# EAGLE design yaca-base (EAGLE 5.11)
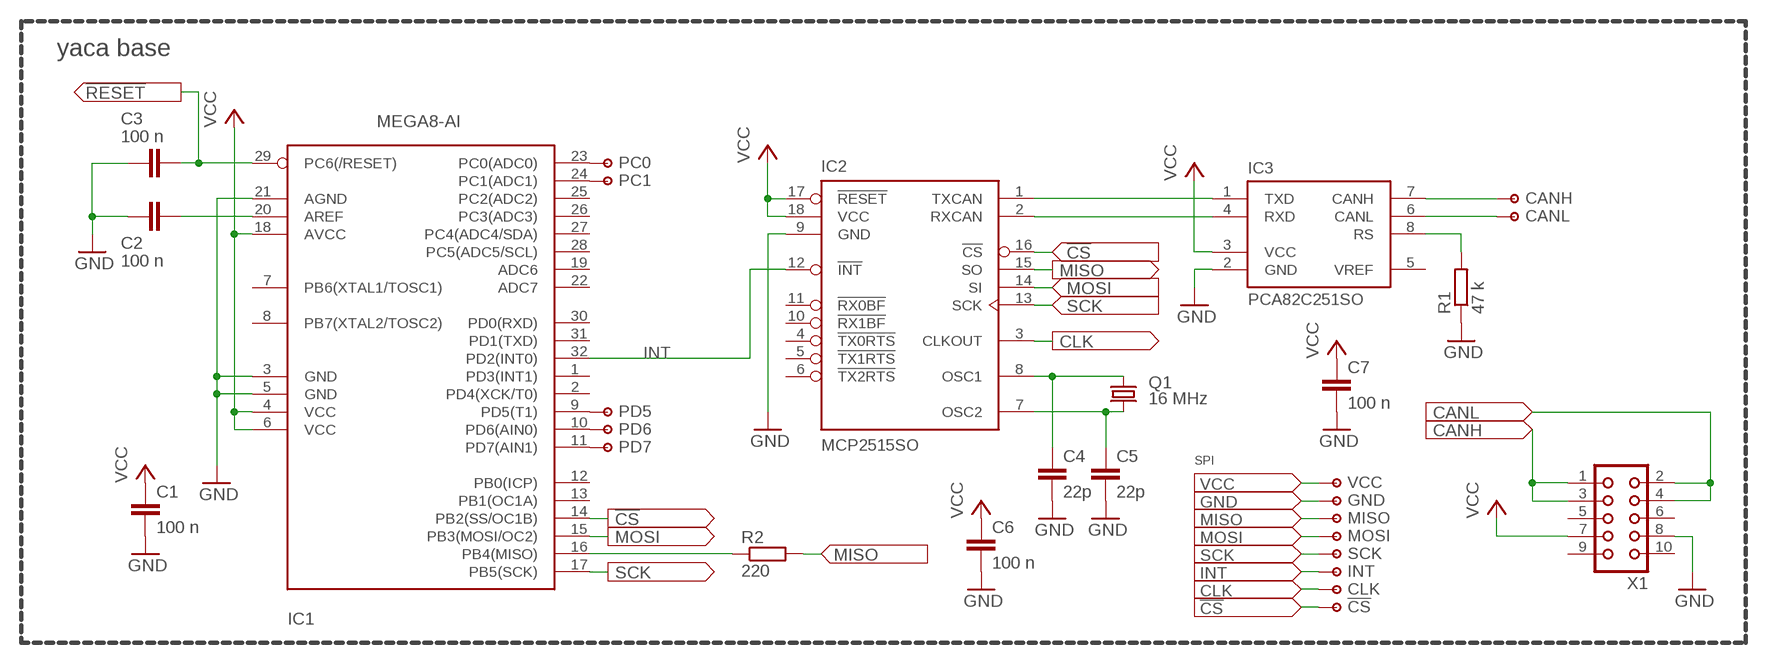
[diagram p0: schematic, sheet 1]

## Parts
C1  100 n  C-EUC0805  [C0805]
C2  100 n  C-EUC0805  [C0805]
C3  100 n  C-EUC1206  [C1206]
C4  22p  C-EUC1206  [C1206]
C5  22p  C-EUC1206  [C1206]
C6  100 n  C-EUC1206  [C1206]
C7  100 n  C-EUC1206  [C1206]
IC1  MEGA8-AI  [TQFP32-08]
IC2  MCP2515SO  [SO18]
IC3  PCA82C251SO  [SO08]
P1  VCC  PAD  [PAD]
P2  GND  PAD  [PAD]
P3  MISO  PAD  [PAD]
P4  MOSI  PAD  [PAD]
P5  SCK  PAD  [PAD]
P6  INT  PAD  [PAD]
P7  CANH  PAD  [PAD]
P8  CANL  PAD  [PAD]
P9  CLK  PAD  [PAD]
P10  !CS  PAD  [PAD]
P11  PC0  PAD  [PAD]
P12  PC1  PAD  [PAD]
P13  PD6  PAD  [PAD]
P14  PD7  PAD  [PAD]
P15  PD5  PAD  [PAD]
Q1  16 MHz  CRYSTALSM49  [SM49]
R1  47 k  R-EU_R0805  [R0805]
R2  220  R-EU_R0805  [R0805]
X1  CON10  [CON10]

## Nets
!CS: IC1.14(PB2(SS/OC1B)) IC2.16(!CS) P10.1(P)
!RESET: C3.1 IC1.29(PC6(/RESET))
CANH: IC3.7(CANH) P7.1(P) X1.1 X1.3
CANL: IC3.6(CANL) P8.1(P) X1.2 X1.4
CLK: IC2.3(CLKOUT) P9.1(P)
GND: C1.2 C2.2 C3.2 C4.2 C5.2 C6.2 C7.2 IC1.3(GND) IC1.5(GND) IC1.21(AGND) IC2.9(GND) IC3.2(GND) P2.1(P) R1.1 X1.8
INT: IC1.32(PD2(INT0)) IC2.12(!INT) P6.1(P)
MISO: IC2.15(SO) P3.1(P) R2.2
MOSI: IC1.15(PB3(MOSI/OC2)) IC2.14(SI) P4.1(P)
N$1: IC1.16(PB4(MISO)) R2.1
N$2: C2.1 IC1.20(AREF)
N$3: IC1.23(PC0(ADC0)) P11.1(P)
N$4: IC1.24(PC1(ADC1)) P12.1(P)
N$5: IC1.10(PD6(AIN0)) P13.1(P)
N$6: IC1.11(PD7(AIN1)) P14.1(P)
N$7: IC1.9(PD5(T1)) P15.1(P)
RS: IC3.8(RS) R1.2
RXCAN: IC2.2(RXCAN) IC3.4(RXD)
SCK: IC1.17(PB5(SCK)) IC2.13(SCK) P5.1(P)
TXCAN: IC2.1(TXCAN) IC3.1(TXD)
VCC: C1.1 C6.1 C7.1 IC1.4(VCC) IC1.6(VCC) IC1.18(AVCC) IC2.17(!RESET) IC2.18(VCC) IC3.3(VCC) P1.1(P) X1.7
X1: C4.1 IC2.8(OSC1) Q1.1
X2: C5.1 IC2.7(OSC2) Q1.2
Unconnected: IC1.1(PD3(INT1)) IC1.2(PD4(XCK/T0)) IC1.7(PB6(XTAL1/TOSC1)) IC1.8(PB7(XTAL2/TOSC2)) IC1.12(PB0(ICP)) IC1.13(PB1(OC1A)) IC1.19(ADC6) IC1.22(ADC7) IC1.25(PC2(ADC2)) IC1.26(PC3(ADC3)) IC1.27(PC4(ADC4/SDA)) IC1.28(PC5(ADC5/SCL)) IC1.30(PD0(RXD)) IC1.31(PD1(TXD)) IC2.4(!TX0RTS) IC2.5(!TX1RTS) IC2.6(!TX2RTS) IC2.10(!RX1BF) IC2.11(!RX0BF) IC3.5(VREF) X1.5 X1.6 X1.9 X1.10

## Notes on the sheet
- yaca base
- SPI

## Library data of the parts
C1-C7 = rcl:C-EU: CAPACITOR, European symbol
IC1 = atmel:MEGA8: MICROCONTROLLER 8 Kbytes FLASH, 1 kbytes SRAM, 512 bytes EEPROM, USART, 6-channel 10 bit ADC, 2-channel 8 bit ADC Pin compatible with Atmega48, ATMega88, ATMega168 Source: avr.lbr
IC2 = yaca:MCP2515: MCP2515 CAN controller from Microchip
IC3 = yaca:PCA82C251: PCA82C251 or MCP2551 CAN transceivers
P1-P15 = yaca:PAD: SMD soldering pad
Q1 = crystal:CRYSTAL: CRYSTAL
R1 R2 = rcl:R-EU_: RESISTOR, European symbol
X1 = con-harting:CON10: CONNECTOR; OC_FARNELL: unknown; OC_NEWARK: unknown

## Board
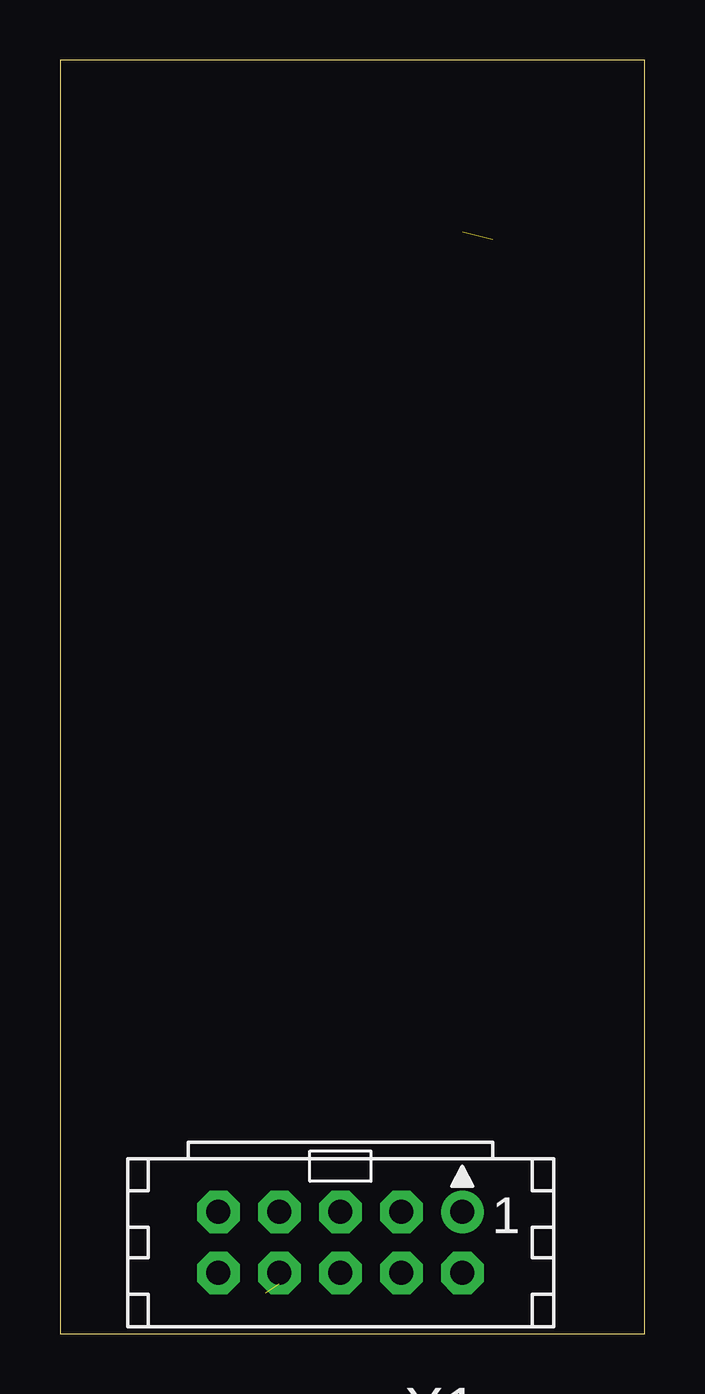
[diagram p1: board, top side]
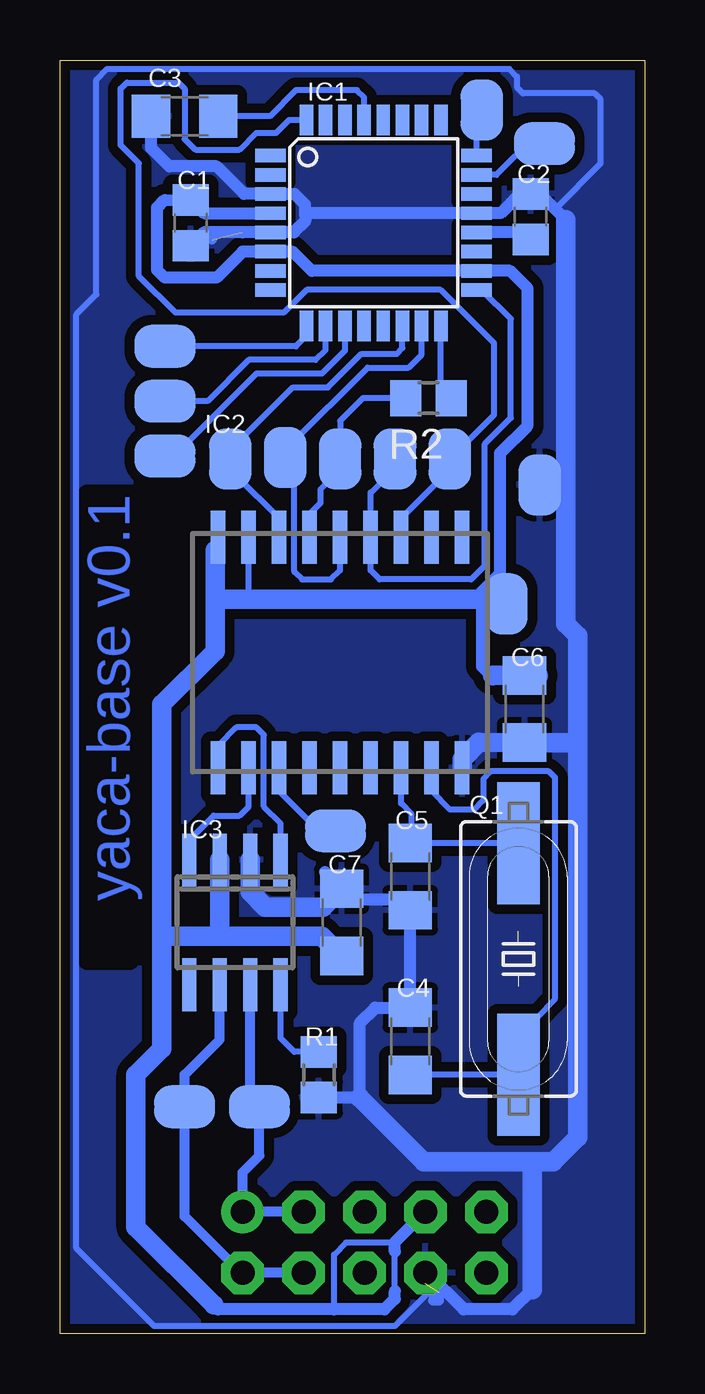
[diagram p2: board, bottom side, seen from below]

Size 24.37 x 53.08 mm. Coordinates in mm from the lower left corner, seen from the top.
Outline: 0,0 24.37,0 24.37,53.08 0,53.08 0,0
Copper layers (1*16): Top 0.035mm / dielectric 1.5mm / Bottom 0.035mm
Design rules "default *": minimum track width 10mil, minimum drill 24mil, track to track 8mil, track to pad 8mil, pad to pad 8mil, via to via 8mil, smd to smd 8mil, copper to edge 8mil, drill to drill 8mil, minimum pad ring 10mil, minimum via ring 8mil, stop-mask expansion 4mil, vias tented up to drill 0mil, thermal gap 10mil

### Footprints (pad centres in the part's own frame; a part is rotated, then mirrored left to right if it is on the bottom)
C0805 = smd 1.3 x 1.5: 1 -0.95,0; 2 0.95,0
C1206 = smd 1.6 x 1.8: 1 -1.4,0; 2 1.4,0
TQFP32-08 = smd 1.27 x 0.559: 1 -4.293,2.8; 2 -4.293,2; 3 -4.293,1.2; 4 -4.293,0.4; 5 -4.293,-0.4; 6 -4.293,-1.2; 7 -4.293,-2; 8 -4.293,-2.8; 17 4.293,-2.8; 18 4.293,-2; 19 4.293,-1.2; 20 4.293,-0.4; 21 4.293,0.4; 22 4.293,1.2; 23 4.293,2; 24 4.293,2.8 | smd 0.559 x 1.27: 9 -2.8,-4.293; 10 -2,-4.293; 11 -1.2,-4.293; 12 -0.4,-4.293; 13 0.4,-4.293; 14 1.2,-4.293; 15 2,-4.293; 16 2.8,-4.293; 25 2.8,4.293; 26 2,4.293; 27 1.2,4.293; 28 0.4,4.293; 29 -0.4,4.293; 30 -1.2,4.293; 31 -2,4.293; 32 -2.8,4.293
SO18 = smd 0.6 x 2.2: 1 -5.08,-4.8; 2 -3.81,-4.8; 3 -2.54,-4.8; 4 -1.27,-4.8; 5 0,-4.8; 6 1.27,-4.8; 7 2.54,-4.8; 8 3.81,-4.8; 9 5.08,-4.8; 10 5.08,4.8; 11 3.81,4.8; 12 2.54,4.8; 13 1.27,4.8; 14 0,4.8; 15 -1.27,4.8; 16 -2.54,4.8; 17 -3.81,4.8; 18 -5.08,4.8
SO08 = smd 0.6 x 2.2: 1 -1.905,-2.6; 2 -0.635,-2.6; 3 0.635,-2.6; 4 1.905,-2.6; 5 1.905,2.6; 6 0.635,2.6; 7 -0.635,2.6; 8 -1.905,2.6
PAD = smd 2.54 x 1.778: 1 0,0
SM49 = smd 5.08 x 1.778: 1 -4.826,0; 2 4.826,0
R0805 = smd 1.3 x 1.5: 1 -0.95,0; 2 0.95,0
CON10 = drill 1 pad 1.778 round: 1 -5.08,-1.27 | drill 1 pad 1.778 octagon: 2 -5.08,1.27; 3 -2.54,-1.27; 4 -2.54,1.27; 5 0,-1.27; 6 0,1.27; 7 2.54,-1.27; 8 2.54,1.27; 9 5.08,-1.27; 10 5.08,1.27

### Placement (x,y rotation side)
C1  18.92,46.29 270 bottom
C2  4.76,46.55 90 bottom
C3  19.18,50.74 180 bottom
C4  9.78,12.19 90 bottom
C5  9.78,19.05 270 bottom
C6  5.02,26.04 270 bottom
C7  12.64,17.14 90 bottom
IC1  11.3,46.29 0 bottom
IC2  12.7,28.38 0 bottom
IC3  17.08,17.14 180 bottom
P1  5.78,30.42 90 bottom
P2  4.38,35.37 270 bottom
P3  12.7,36.45 270 bottom
P4  14.99,36.51 90 bottom
P5  10.41,36.45 270 bottom
P6  8.13,36.45 270 bottom
P7  16.07,9.46 180 bottom
P8  19.18,9.46 0 bottom
P9  12.89,20.95 0 bottom
P10  17.27,36.45 270 bottom
P11  4.19,49.59 0 bottom
P12  6.79,50.99 270 bottom
P13  20,38.86 0 bottom
P14  20,36.58 0 bottom
P15  20,41.15 180 bottom
Q1  5.27,15.62 90 bottom
R1  13.59,10.79 90 bottom
R2  9.02,38.99 180 bottom
X1  11.68,3.81 180 top

### Tracks (layer width: path | path; a pad name or v marks a point on that pad's centre or on a via)
!CS
  Bottom 0.254: IC2.16 15.24,33.97 17.02,35.75 17.02,36.2 P10.1 17.08,36.64 17.08,37.02 14.67,39.43 13.21,39.43 11.81,40.83 10.35,40.83 10.1,41.08 IC1.14
!RESET
  Bottom 0.254: C3.1 15.62,50.74 14.54,51.82 12,51.82 11.7,51.52 IC1.29
CANH
  Bottom 0.254: IC3.7 16.45,15.3
  Bottom 0.406: IC3.7 16.45,9.84 P7.1 16.07,7.43 16.76,6.73 X1.1 X1.3
CANL
  Bottom 0.406: IC3.6 17.72,12.26 19.18,10.79 P8.1 19.18,4.89 16.83,2.54 X1.2 X1.4
CLK
  Bottom 0.254: IC2.3 15.24,22.61 13.91,21.27 13.21,21.27 P9.1
GND  (2 unrouted)
  Bottom 0.254: 12.32,18.09 C7.2 | P2.1 3.68,35.37 3.3,34.99 | 9.08,2.54 X1.8 9.14,2.1 9.14,1.59 10.41,0.32 20.45,0.32 23.69,3.56 23.69,42.48 22.86,43.31 22.86,52.26 22.42,52.7 5.65,52.7 5.33,52.39 5.33,51.94 5.08,51.69 2.1,51.69 1.84,51.44 1.84,48.77 3.75,46.86
  Bottom 0.406: 16.78,45.89 18.03,45.89 18.03,45.59 | 9.14,2.1 8.83,2.1 8.83,1.4 8.57,1.4 8.57,1.71
  Bottom 0.508: C1.2 18.37,45.89 16.78,45.89 IC1.5 14.62,45.89 14.16,46.35 14.16,46.61 | 14.16,46.61 14.16,47.05 14.6,47.49 IC1.3 16.7,47.5 17.84,48.64 19.81,48.64 20.57,49.4 C3.2 | 14.16,46.61 14.08,46.69 IC1.21 6.01,46.69 5.21,47.5 C2.2 4.38,47.49 3.75,46.86 3.3,46.42 | C6.2 4.89,24.64 4.45,24.64 | 12.32,18.09 9.78,18.09 9.78,18.16 C5.2 C4.2 11.24,13.59 11.87,12.95 11.87,9.84 11.88,9.85 R1.1 | C7.2 13.34,19.24 | 9.08,2.54 7.56,1.02 5.52,1.02 4.7,1.84
  Bottom 0.813: C6.2 6.92,24.64 7.62,23.94 IC2.9 | 2.79,24.64 4.45,24.64 | IC3.2 16.45,18.41 15.81,17.78 13.4,17.78 C7.2 | 3.3,46.42 3.3,34.99 3.3,29.59 2.79,29.08 2.79,24.64 | 2.79,24.64 2.79,8.19 3.81,7.18 4.76,7.18 | 4.76,7.18 9.21,7.18 11.87,9.84 | 4.7,1.84 4.7,7.11 4.76,7.18
  pour Bottom (isolate 0.406): 0,53.09 0,0 24.38,0 24.38,53.09
INT
  Bottom 0.254: IC1.32 14.82,50.58 15.37,50.04 16.19,50.04 16.89,49.34 18.73,49.34 19.18,49.78 19.18,51.88 19.43,52.13 21.59,52.13 21.84,51.88 21.84,49.53 21.08,48.77 21.08,44.07 19.56,42.55 15.05,42.55 14.1,43.5 8.51,43.5 6.29,41.27 6.29,38.29 P6.1 8.26,36.26 8.26,35.88 10.16,33.97 IC2.12
MISO
  Bottom 0.254: IC2.15 13.97,34.16 13.53,34.61 13.53,35.18 13.14,35.56 13.14,36.01 P3.1 12.7,38.04 11.75,38.99 R2.2
MOSI
  Bottom 0.254: IC2.14 12.7,31.81 13.08,31.43 14.29,31.43 14.61,31.75 14.61,36.13 P4.1 14.8,36.7 14.8,37.02 11.56,40.26 9.84,40.26 9.3,40.8 IC1.15
N$1
  Bottom 0.254: IC1.16 8.5,39.55 R2.1
N$2
  Bottom 0.508: IC1.20 4.8,45.89 C2.1
N$3
  Bottom 0.254: IC1.23 6.19,48.29 5.4,49.09 4.7,49.09 P11.1
N$4
  Bottom 0.254: IC1.24 7.01,50.77 P12.1
N$5
  Bottom 0.254: IC1.10 13.3,40.99 13.72,40.58 16.51,40.58 18.22,38.86 P13.1
N$6
  Bottom 0.254: IC1.11 12.5,40.96 13.46,40.01 16.19,40.01 19.49,36.7 19.88,36.7 P14.1
N$7
  Bottom 0.254: IC1.9 14.1,41.59 14.54,41.15 P15.1
RS
  Bottom 0.254: IC3.8 15.18,13.33 15.17,12.95 15.18,12.95 15.18,12.32 14.61,11.75 R1.2 13.34,12
RXCAN
  Bottom 0.254: IC2.2 16.51,21.97 16.89,21.59 17.97,21.59 18.99,20.57 IC3.4
SCK
  Bottom 0.254: IC1.17 6.98,43.43 6.79,43.49 5.59,42.29 5.59,38.16 6.67,37.08 6.67,32 7.24,31.43 11.05,31.43 11.43,31.81 IC2.13 11.43,35.05 10.41,36.07 P5.1
TXCAN
  Bottom 0.254: IC2.1 17.78,24.51 17.02,25.27 16.19,25.27 15.88,24.96 15.88,21.97 15.18,21.27 IC3.1
VCC
  Bottom 0.254: 17.91,32.64 IC2.18 | 17.91,30.67 17.72,30.67 | P1.1 6.73,30.04 6.79,29.97 | 16.51,30.61 IC2.17 | 10.41,1.78 10.41,3.43 | 10.41,3.81 12.45,3.81 12.95,3.3 12.95,1.02
  Bottom 0.508: 15.58,46.67 IC1.4 18.37,46.69 C1.1 19.31,47.24 20,47.24 20.32,46.93 20.32,44.32 20,44.01 17.84,44.01 16.76,45.09 IC1.6 14.67,45.09 13.88,44.29 IC1.18 5.62,44.29 4.89,43.56 4.89,37.85 6.03,36.7 6.03,31.69 6.79,30.92 6.79,30.61 6.79,29.97 6.79,27.81 6.41,27.43 4.45,27.43 | X1.7 10.41,3.81 10.41,3.43 | 10.41,1.78 10.41,1.46 10.86,1.02 12.95,1.02 17.78,1.02 17.97,1.21
  Bottom 0.813: 6.35,27.43 4.51,27.43 4.45,27.43 C6.1 | 17.91,32.64 17.91,30.67 17.91,28.45 20.13,26.23 20.13,16.57 | 17.72,16.57 IC3.3 | 17.72,16.57 13.46,16.57 C7.1 | 6.79,30.61 16.51,30.61 17.65,30.61 17.72,30.67 | 20.13,16.57 17.72,16.57 | 17.97,1.21 21.21,4.45 21.21,10.79 20.13,11.87 20.13,16.57
X1
  Bottom 0.254: IC2.8 8.89,22.61 8.13,21.84 7.11,21.84 6.73,22.23 6.73,23.11 6.41,23.43 4,23.43 3.75,23.18 3.75,13.97 5.27,12.38 Q1.1 C4.1
X2
  Bottom 0.254: IC2.7 10.16,22.1 9.72,21.65 9.72,20.32 10.16,21.08 9.78,20.7 C5.1 Q1.2

### Text on the board
Bottom: yaca-base v0.1